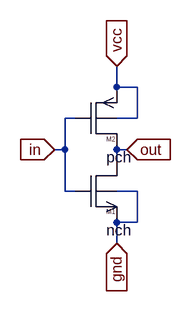
[diagram p0: schematic myinv_L2W14p22.asc]
myinv_L2W14p22.asc, the LTspice schematic file:
Version 4
SHEET 1 880 680
WIRE 176 32 176 0
WIRE 208 32 176 32
WIRE 112 80 96 80
WIRE 208 80 208 32
WIRE 208 80 176 80
WIRE 96 128 96 80
WIRE 96 128 80 128
WIRE 192 128 176 128
WIRE 176 144 176 128
WIRE 96 192 96 128
WIRE 112 192 96 192
WIRE 208 192 176 192
WIRE 208 240 208 192
WIRE 208 240 176 240
WIRE 176 272 176 240
FLAG 176 272 gnd
IOPIN 176 272 In
FLAG 176 0 vcc
IOPIN 176 0 In
FLAG 80 128 in
IOPIN 80 128 In
FLAG 192 128 out
IOPIN 192 128 In
SYMBOL nmos4 112 192 R0
WINDOW 3 48 60 Left 2
SYMATTR InstName M1
SYMATTR Value nch
SYMATTR Value2 l=2u w=14u
SYMBOL pmos4 112 80 R0
WINDOW 3 48 60 Left 2
SYMATTR InstName M2
SYMATTR Value pch
SYMATTR Value2 l=2u w=22u

The netlist it stands for:
* myinv_L2W14p22.asc
M1 out in gnd gnd nch l=2u w=14u
M2 out in vcc vcc pch l=2u w=22u
.model NMOS NMOS
.model PMOS PMOS
.lib standard.mos
.backanno
.end